# Altium schematic sheet MikroBus.SchDoc
size A4; SheetNumber: 9; SheetTotal: 11
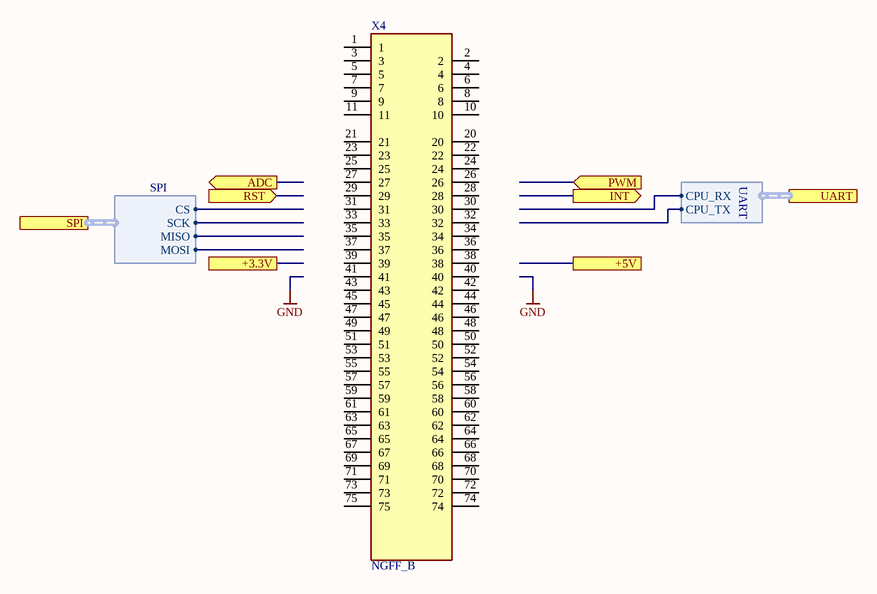
[diagram p0: MikroBus.SchDoc]

## Parts
X4  NGFF_B  [NGFF_B3_30MM]

## Ports
+3.3V, +5V, ADC (out), INT (out), PWM (in), RST (in), SPI (harness SPI), UART (harness UART)

## Harnesses
SPI: CS, SCK, MISO, MOSI
UART: CPU_RX, CPU_TX

## Nets

Not connected (* = marked no-connect by the designer): X4 1 2 3 4 5 6 7 8 9 10 11 20 21 22 23 24 25 26 27 28 29 30 31 32 33 34 35 36 37 38 39 40 41 42 43 44 45 46 47 48 49 50 51 52 53 54 55 56 57 58 59 60 61 62 63 64 65 66 67 68 69 70 71 72 73 74 75

## Library data of the parts
X4 = NGFF_B: M.2 0.5PITCH 4.2H KEY B 15U'' AU